# EAGLE design mono3 (EAGLE 5.11)
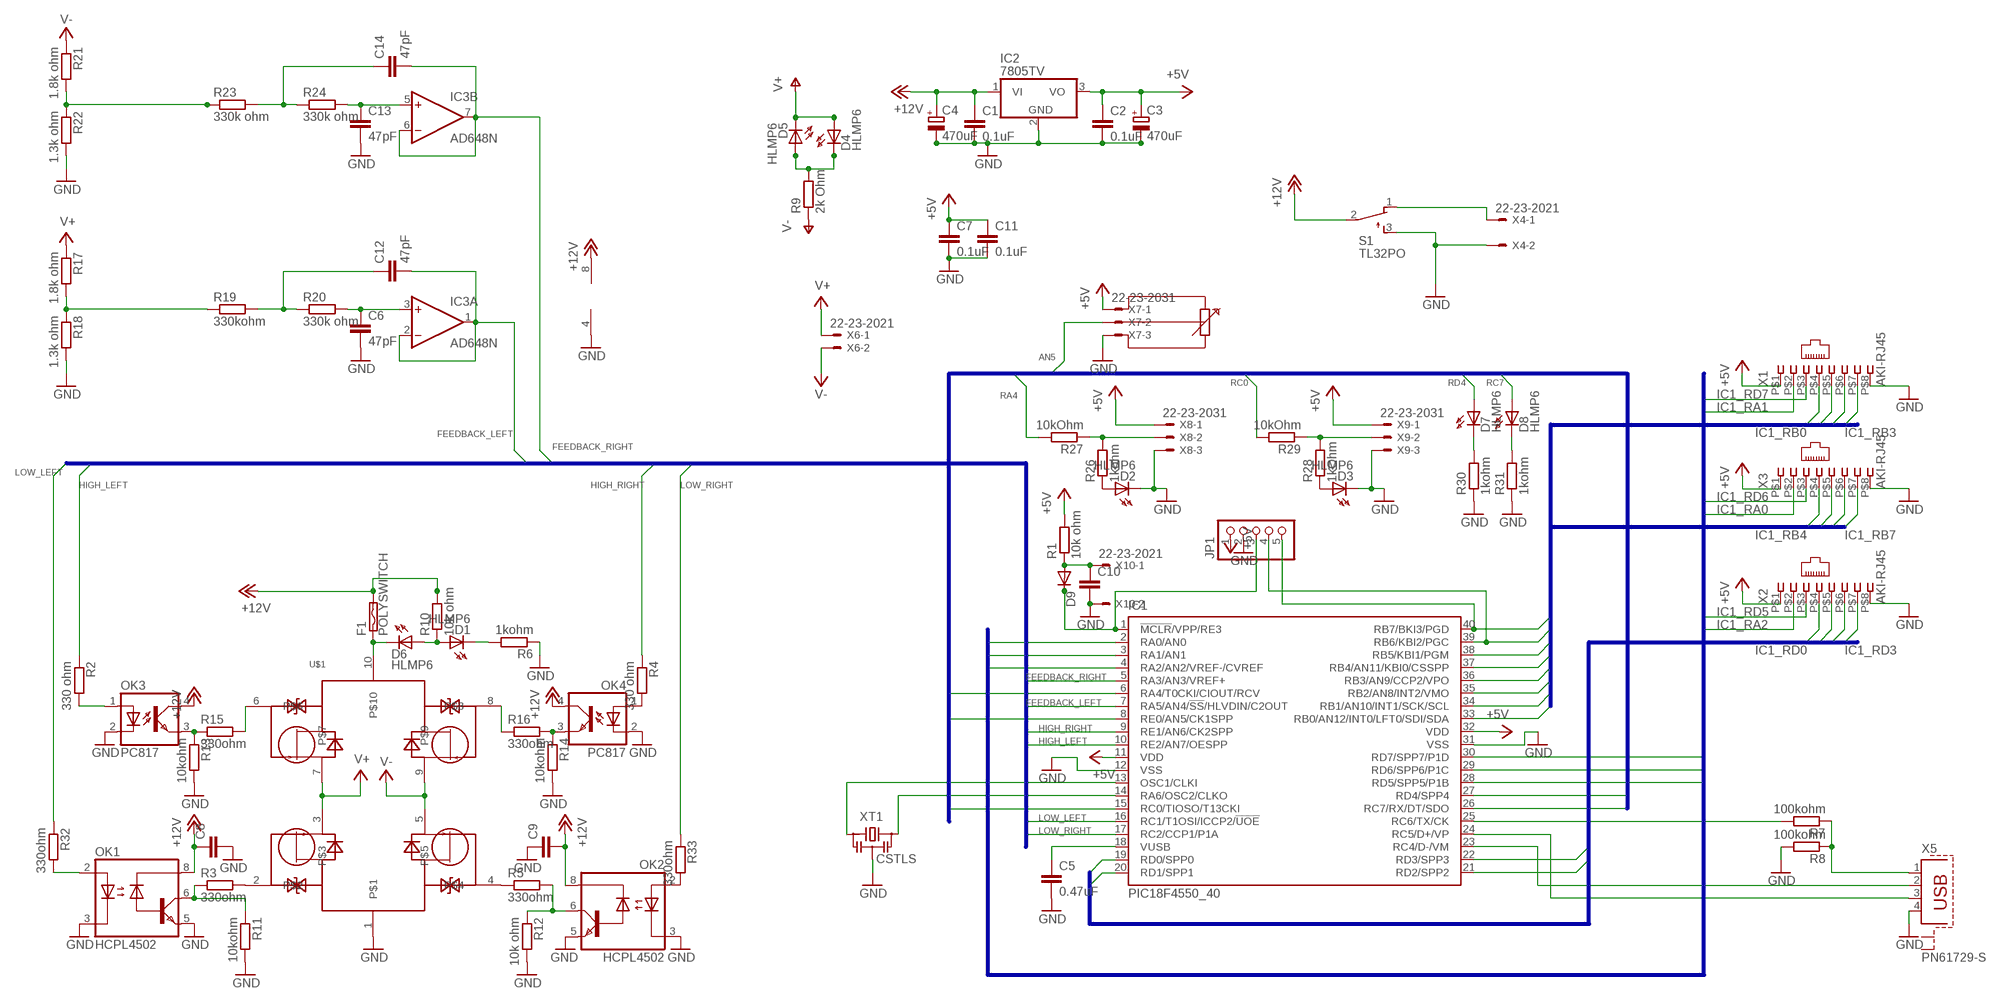
[diagram p0: schematic, sheet 1]

## Parts
C1  0.1uF  C-EU025-025X050  [C025-025X050]
C2  0.1uF  C-EU025-025X050  [C025-025X050]
C3  470uF  CPOL-EUE3.5-8  [E3,5-8]
C4  470uF  CPOL-EUE3.5-8  [E3,5-8]
C5  0.47uF  C-EU025-025X050  [C025-025X050]
C6  47pF  C-EU025-025X050  [C025-025X050]
C7  0.1uF  C2,5-3  [C2.5-3]
C8  C-EU025-025X050  [C025-025X050]
C9  C-EU025-025X050  [C025-025X050]
C10  C2,5-3  [C2.5-3]
C11  0.1uF  C2,5-3  [C2.5-3]
C12  47pF  C-EU025-025X050  [C025-025X050]
C13  47pF  C-EU025-025X050  [C025-025X050]
C14  47pF  C-EU025-025X050  [C025-025X050]
D1  HLMP6  [HLMP6]
D2  HLMP6  [HLMP6]
D3  HLMP6  [HLMP6]
D4  HLMP6  [HLMP6]
D5  HLMP6  [HLMP6]
D6  HLMP6  [HLMP6]
D7  HLMP6  [HLMP6]
D8  HLMP6  [HLMP6]
D9  DIODE-D-2.5  [D-2.5]
F1  POLYSWITCH  [0207/2V]
IC1  PIC18F4550_40  [DIL40]
IC2  7805TV  [TO220V]
IC3  AD648N  [DIL08]
JP1  PINHD-1X5  [1X05]
OK1  HCPL4502  [DIL08]
OK2  HCPL4502  [DIL08]
OK3  PC817  [DIL04]
OK4  PC817  [DIL04]
R1  10k ohm  R-EU_0204/2V  [0204V]
R2  330 ohm  R-EU_0204/2V  [0204V]
R3  330ohm  R-EU_0204/2V  [0204V]
R4  330 ohm  R-EU_0204/2V  [0204V]
R5  330ohm  R-EU_0204/2V  [0204V]
R6  1kohm  R-EU_0204/2V  [0204V]
R7  100kohm  R-EU_0204/2V  [0204V]
R8  100kohm  R-EU_0204/2V  [0204V]
R9  2k Ohm  R-EU_0204/2V  [0204V]
R10  10k ohm  R-EU_0204/2V  [0204V]
R11  10kohm  R-EU_0204/2V  [0204V]
R12  10k ohm  R-EU_0204/2V  [0204V]
R13  10kohm  R-EU_0204/2V  [0204V]
R14  10kohm  R-EU_0204/2V  [0204V]
R15  330ohm  R-EU_0204/2V  [0204V]
R16  330ohm  R-EU_0204/2V  [0204V]
R17  1.8k ohm  R-EU_0204/2V  [0204V]
R18  1.3k ohm  R-EU_0204/2V  [0204V]
R19  330kohm  R-EU_0204/2V  [0204V]
R20  330k ohm  R-EU_0204/2V  [0204V]
R21  1.8k ohm  R-EU_0204/2V  [0204V]
R22  1.3k ohm  R-EU_0204/2V  [0204V]
R23  330k ohm  R-EU_0204/2V  [0204V]
R24  330k ohm  R-EU_0204/2V  [0204V]
R26  1kohm  R-EU_0204/2V  [0204V]
R27  10kOhm  R-EU_0204/2V  [0204V]
R28  1kOhm  R-EU_0204/2V  [0204V]
R29  10kOhm  R-EU_0204/2V  [0204V]
R30  1kohm  R-EU_0204/2V  [0204V]
R31  1kohm  R-EU_0204/2V  [0204V]
R32  330ohm  R-EU_0204/2V  [0204V]
R33  330ohm  R-EU_0204/2V  [0204V]
S1  TL32PO  [TL3XPO]
U$1  MP4212  [SSW-110-02-S-S-RA]
X1  AKI-RJ45  [C-00159]
X2  AKI-RJ45  [C-00159]
X3  AKI-RJ45  [C-00159]
X4  22-23-2021  [22-23-2021]
X5  PN61729-S  [PN61729-S]
X6  22-23-2021  [22-23-2021]
X7  22-23-2031  [22-23-2031]
X8  22-23-2031  [22-23-2031]
X9  22-23-2031  [22-23-2031]
X10  22-23-2021  [22-23-2021]
XT1  CSTLS  [S3P]

## Nets
+5V: C2.1 C3.+ C7.1 C11.1 IC1.11(VDD) IC1.32(VDD) IC2.3(VO) JP1.1 R1.2 X1.P$1 X2.P$1 X3.P$1 X7.1 X8.1 X9.1
+12V [pwr]: C1.1 C4.+ C8.1 C9.2 F1.2 IC2.1(VI) IC3.8(P:V+) OK1.8(VCC) OK2.8(VCC) OK3.4(COL) OK4.4(COL) R10.2 S1.2(P)
AN5: IC1.8(RE0/AN5/CK1SPP) X7.2
FEEDBACK_LEFT: C12.2 IC1.7(RA5/AN4/!SS!/HLVDIN/C2OUT) IC3.1(A:OUT) IC3.2(A:-IN)
FEEDBACK_RIGHT: C14.2 IC1.5(RA3/AN3/VREF+) IC3.6(B:-IN) IC3.7(B:OUT)
GND: C1.2 C2.2 C3.- C4.- C5.2 C6.2 C7.2 C8.2 C9.1 C10.2 C11.2 C13.2 D2.K D3.K IC1.12(VSS) IC1.31(VSS) IC2.2(GND) IC3.4(P:V-) JP1.2 OK1.3(C) OK1.5(GND) OK2.3(C) OK2.5(GND) OK3.2(C) OK4.2(C) R6.1 R8.2 R11.2 R12.2 R13.2 R14.2 R18.2 R22.2 R30.1 R31.1 S1.3(S) U$1.1 X1.P$8 X2.P$8 X3.P$8 X4.2 X5.4 X7.3 X8.3 X9.3 X10.2 XT1.P$2
HIGH_LEFT: IC1.10(RE2/AN7/OESPP) R2.1
HIGH_RIGHT: IC1.9(RE1/AN6/CK2SPP) R4.1
IC1_RA0: IC1.2(RA0/AN0) X3.P$2
IC1_RA1: IC1.3(RA1/AN1) X1.P$2
IC1_RA2: IC1.4(RA2/AN2/VREF-/CVREF) X2.P$2
IC1_RB0: IC1.33(RB0/AN12/INT0/LFT0/SDI/SDA) X1.P$4
IC1_RB1: IC1.34(RB1/AN10/INT1/SCK/SCL) X1.P$5
IC1_RB2: IC1.35(RB2/AN8/INT2/VMO) X1.P$6
IC1_RB3: IC1.36(RB3/AN9/CCP2/VPO) X1.P$7
IC1_RB4: IC1.37(RB4/AN11/KBI0/CSSPP) X3.P$4
IC1_RB5: IC1.38(RB5/KBI1/PGM) X3.P$5
IC1_RB6: IC1.39(RB6/KBI2/PGC) JP1.4 X3.P$6
IC1_RB7: IC1.40(RB7/BKI3/PGD) JP1.5 X3.P$7
IC1_RD0: IC1.19(RD0/SPP0) X2.P$4
IC1_RD1: IC1.20(RD1/SPP1) X2.P$5
IC1_RD2: IC1.21(RD2/SPP2) X2.P$6
IC1_RD3: IC1.22(RD3/SPP3) X2.P$7
IC1_RD5: IC1.28(RD5/SPP5/P1B) X2.P$3
IC1_RD6: IC1.29(RD6/SPP6/P1C) X3.P$3
IC1_RD7: IC1.30(RD7/SPP7/P1D) X1.P$3
LOW_LEFT: IC1.16(RC1/T1OSI/ICCP2/!UOE) R32.1
LOW_RIGHT: IC1.17(RC2/CCP1/P1A) R33.1
N$1: C5.1 IC1.18(VUSB)
N$2: IC1.14(RA6/OSC2/CLKO) XT1.P$3
N$3: R17.2 R18.1 R19.1
N$4: D9.C IC1.1(!MCLR!/VPP/RE3) JP1.3
N$5: R3.2 U$1.2
N$6: C12.1 R19.2 R20.1
N$7: R5.1 U$1.4
N$8 [pwr]: S1.1(O) X4.1
N$9: C6.1 IC3.3(A:+IN) R20.2
N$10: C10.1 D9.A R1.1 X10.1
N$11: C14.1 R23.2 R24.1
N$12: R21.2 R22.1 R23.1
N$13: C13.1 IC3.5(B:+IN) R24.2
N$14: IC1.13(OSC1/CLKI) XT1.P$1
N$15: D1.K R6.2
N$16: IC1.25(RC6/TX/CK) R7.2
N$17: R7.1 R8.1 X5.1
N$18: R26.2 R27.1 X8.2
N$19: D2.A R26.1
N$20: R28.2 R29.1 X9.2
N$21: D3.A R28.1
N$22: D7.K R30.2
N$23: D8.K R31.2
N$24: OK3.1(A) R2.2
N$25 [pwr]: D6.K F1.1 U$1.10
N$26: OK1.6(VO) R3.1 R11.1
N$27: IC1.24(RC5/D+/VP) X5.3
N$28: OK1.2(A) R32.2
N$29: IC1.23(RC4/D-/VM) X5.2
N$30: OK2.6(VO) R5.2 R12.1
N$31: OK2.2(A) R33.2
N$35: D4.K D5.A R9.2
N$36: D1.A D6.A R10.1
N$38: OK4.1(A) R4.2
N$39: R15.2 U$1.6
N$41: OK3.3(EMIT) R13.1 R15.1
N$42: OK4.3(EMIT) R14.1 R16.2
N$43: R16.1 U$1.8
RA4: IC1.6(RA4/T0CKI/CIOUT/RCV) R27.2
RC0: IC1.15(RC0/TIOSO/T13CKI) R29.2
RC7: D8.A IC1.26(RC7/RX/DT/SDO)
RD4: D7.A IC1.27(RD4/SPP4)
V+ [pwr]: D4.A D5.K R17.1 U$1.3 U$1.7 X6.1
V- [pwr]: R9.1 R21.1 U$1.5 U$1.9 X6.2
Unconnected: X5.S1 X5.S2

## Buses
IC1_RB[0..7]
IC1_RD[0..3]
IC1_RA[0..3],IC1_RD[5..7]
HIGH_LEFT,HIGH_RIGHT,LOW_LEFT,LOW_RIGHT,FEEDBACK_LEFT,FEEDBACK_RIGHT
AN5,RA4,RC0,RD4,RC7

## Library data of the parts
C1 C2 C5 C6 C8 C9 C12-C14 = rcl:C-EU: CAPACITOR, European symbol
C3 C4 = rcl:CPOL-EU: POLARIZED CAPACITOR, European symbol
C7 C10 C11 = capacitor-wima:C: CAPACITOR naming: grid - package width
D1-D8 = display-hp:HLMP6: LED 2mm horizontal; MF: AGILENT TECHNOLOGIES; MPN: HLMP-6500; OC_FARNELL: 1652490; OC_NEWARK: 40K0088
D9 = diode:DIODE-: DIODE
F1 = myparts:POLYSWITCH
IC1 = microchip:PIC18F4*_40: USB Microcontrollers with nanoWatt Technology High-Performance, Enhanced Flash, 28/40/44-Pin, Source: http://ww1.microchip.com/downloads/en/devicedoc/39632c.pdf; MF: MICROCHIP; MPN: PIC18F4550-I/P; OC_FARNELL: 9321357; OC_NEWARK: 74K8623
IC2 = linear:78*: Positive VOLTAGE REGULATOR Source: http://cache.national.com/ds/LM/LM78L05.pdf http://www.fairchildsemi.com/ds/LM/LM7805.pdf
IC3 = linear:AD648: OP AMP
JP1 = pinhead:PINHD-1X5: PIN HEADER
OK1 OK2 = optocoupler:HCPL4502: HEWLETT PACKARD OPTO COUPLER; MF: AGILENT TECHNOLOGIES; MPN: HCPL-4502-000E; OC_FARNELL: 9994777; OC_NEWARK: 31K7017
OK3 OK4 = optocoupler:PC817: SHARP OPTO COUPLER; MPN: PC817X4J000F; OC_FARNELL: 9707727; OC_NEWARK: 97K7059
R1 R7 R8 R26-R29 = rcl:R-EU_: RESISTOR, European symbol
R2-R6 R9-R24 R30-R33 = resistor:R-EU_: RESISTOR, European symbol
S1 = switch:TL32PO: TINY SWITCH ON - MOM Source: http://www2.produktinfo.conrad.com/datenblaetter/700000-724999/705152-da-01-de-Subminiaturschalter_TL_36YO.pdf
U$1 = myparts:MP4212
X1-X3 = myparts:AKI-RJ45
X4 X6 X10 = con-molex:22-23-2021: .100" (2.54mm) Center Header - 2 Pin; MF: MOLEX; MPN: 22-23-2021; OC_FARNELL: 1462926; OC_NEWARK: 25C3832
X5 = con-berg:PN61729-S: BERG USB connector; OC_FARNELL: unknown; OC_NEWARK: unknown
X7-X9 = con-molex:22-23-2031: .100" (2.54mm) Center Header - 3 Pin; MF: MOLEX; MPN: 22-23-2031; OC_FARNELL: 1462950; OC_NEWARK: 30C0862
XT1 = TOG:CSTLS: Resonator, Murata Ceralock

## Net classes
1 pwr: width 0.762 mm

## Board
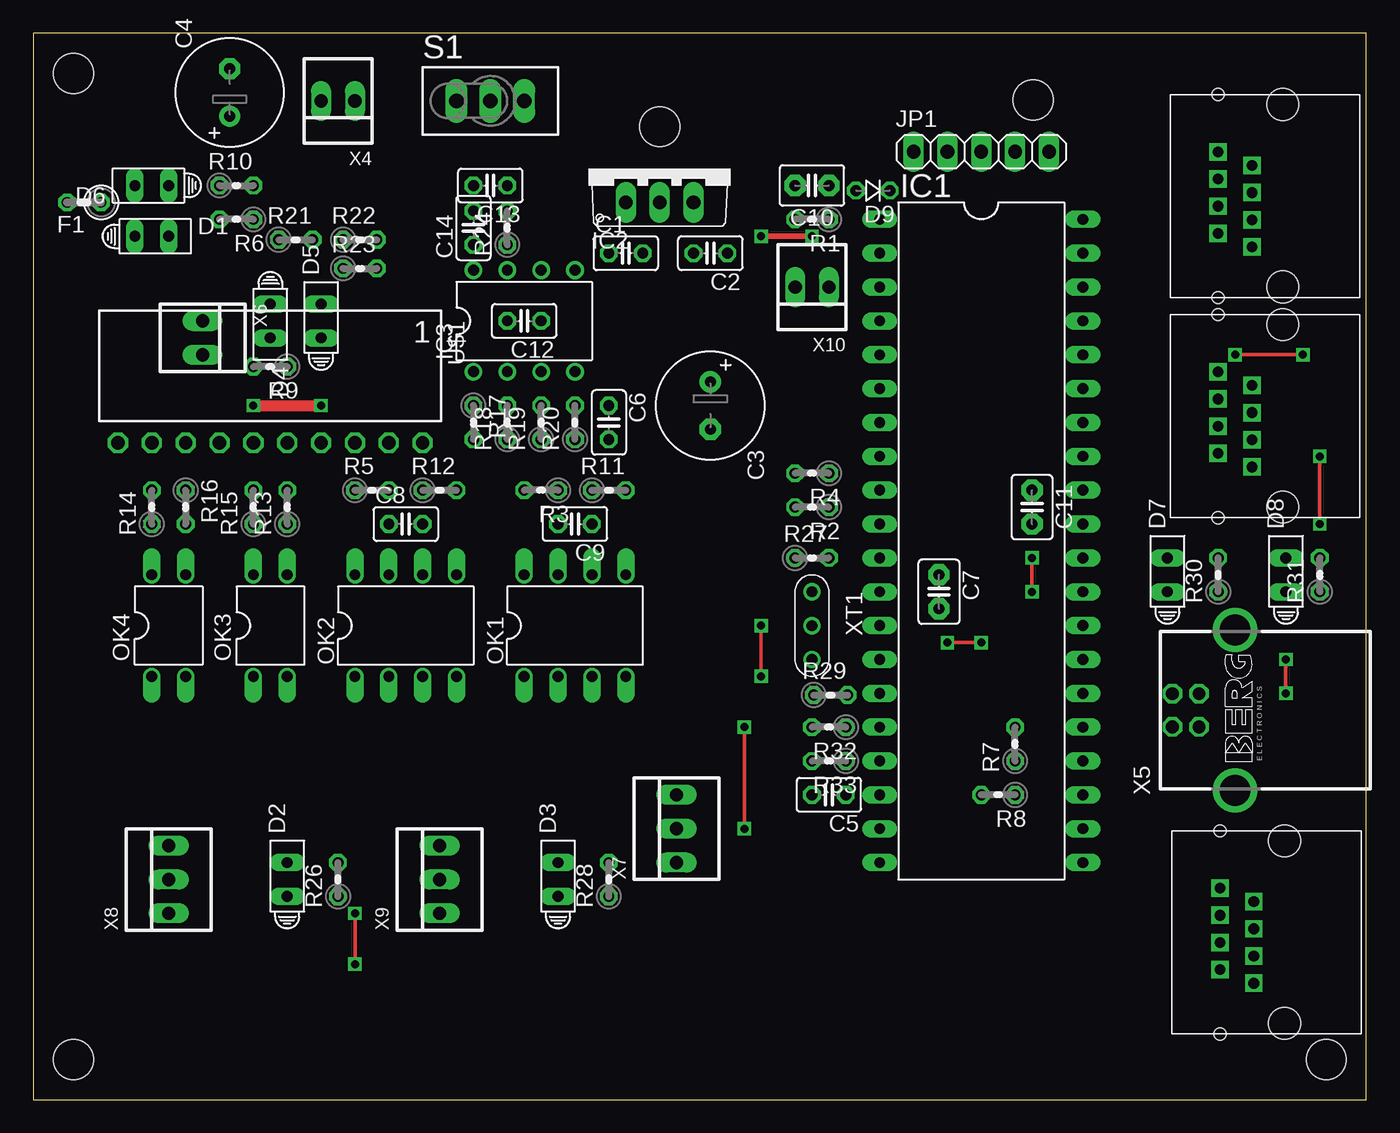
[diagram p1: board, top side]
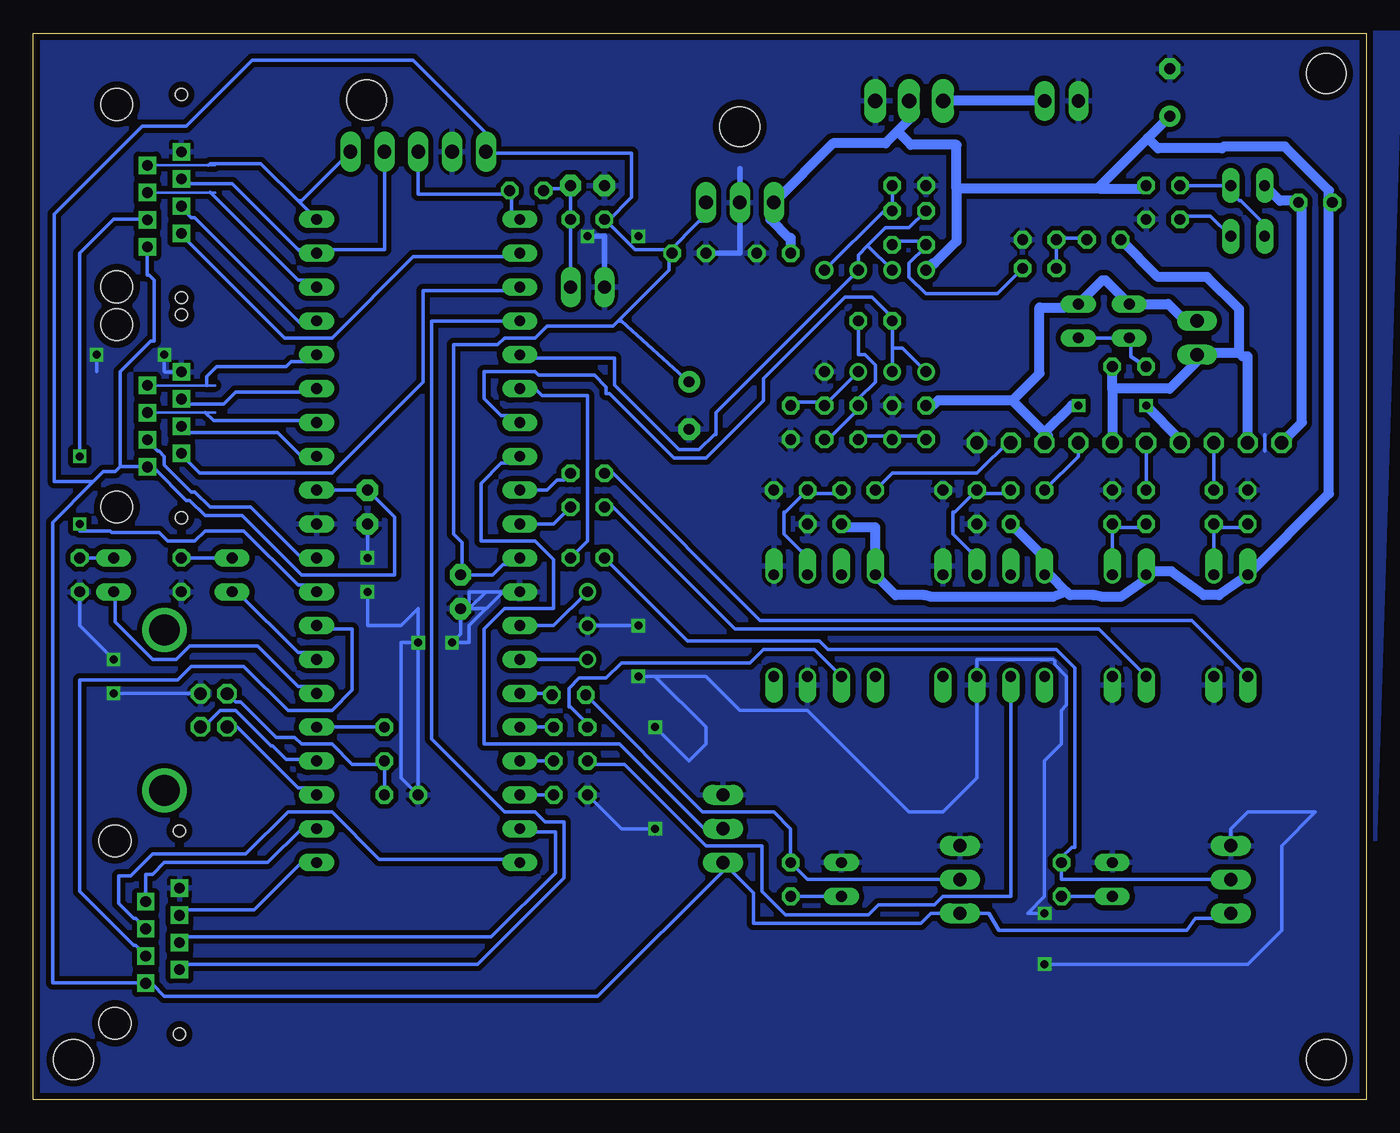
[diagram p2: board, bottom side, seen from below]

Size 100 x 80 mm. Coordinates in mm from the lower left corner, seen from the top.
Outline: 0,0 100,0 100,80 0,80 0,0
Copper layers (1*16): Top 0.035mm / dielectric 1.5mm / Bottom 0.035mm
Design rules "default *": minimum track width 10mil, minimum drill 24mil, track to track 15mil, track to pad 15mil, pad to pad 15mil, via to via 15mil, smd to smd 15mil, copper to edge 20mil, drill to drill 8mil, minimum pad ring 10mil, minimum via ring 8mil, stop-mask expansion 4mil, vias tented up to drill 0mil, thermal gap 10mil
Holes 3 mm at 3,3 3,77 97,3 75,75 47,73

### Footprints (pad centres in the part's own frame; a part is rotated, then mirrored left to right if it is on the bottom)
C025-025X050 = drill 0.813 octagon: 1 -1.27,0; 2 1.27,0
E3,5-8 = drill 0.813 pad 1.6 round: + -1.778,0 | drill 0.813 pad 1.6 octagon: - 1.778,0
C2.5-3 = drill 0.813 pad 1.6 octagon: 1 -1.27,0; 2 1.27,0
HLMP6 = drill 0.813 long: A -1.27,0; K 1.27,0
D-2.5 = drill 0.813 octagon: A 1.27,0; C -1.27,0
0207/2V = drill 0.813 octagon: 1 -1.27,0; 2 1.27,0
DIL40 = drill 0.813 long: 1 -24.13,-7.62; 2 -21.59,-7.62; 3 -19.05,-7.62; 4 -16.51,-7.62; 5 -13.97,-7.62; 6 -11.43,-7.62; 7 -8.89,-7.62; 8 -6.35,-7.62; 9 -3.81,-7.62; 10 -1.27,-7.62; 11 1.27,-7.62; 12 3.81,-7.62; 13 6.35,-7.62; 14 8.89,-7.62; 15 11.43,-7.62; 16 13.97,-7.62; 17 16.51,-7.62; 18 19.05,-7.62; 19 21.59,-7.62; 20 24.13,-7.62; 21 24.13,7.62; 22 21.59,7.62; 23 19.05,7.62; 24 16.51,7.62; 25 13.97,7.62; 26 11.43,7.62; 27 8.89,7.62; 28 6.35,7.62; 29 3.81,7.62; 30 1.27,7.62; 31 -1.27,7.62; 32 -3.81,7.62; 33 -6.35,7.62; 34 -8.89,7.62; 35 -11.43,7.62; 36 -13.97,7.62; 37 -16.51,7.62; 38 -19.05,7.62; 39 -21.59,7.62; 40 -24.13,7.62
TO220V = drill 1.016 long: 1 -2.54,-2.54; 2 0,-2.54; 3 2.54,-2.54
DIL08 = drill 0.813 pad 1.27 round: 1 -3.81,-3.81; 2 -1.27,-3.81; 3 1.27,-3.81; 4 3.81,-3.81; 5 3.81,3.81; 6 1.27,3.81; 7 -1.27,3.81; 8 -3.81,3.81
1X05 = drill 1.016 long: 1 -5.08,0; 2 -2.54,0; 3 0,0; 4 2.54,0; 5 5.08,0
DIL08' = drill 0.813 offset: 1 -3.81,-3.81; 2 -1.27,-3.81; 3 1.27,-3.81; 4 3.81,-3.81; 5 3.81,3.81; 6 1.27,3.81; 7 -1.27,3.81; 8 -3.81,3.81
DIL04 = drill 0.813 offset: 1 -1.27,-3.81; 2 1.27,-3.81; 3 1.27,3.81; 4 -1.27,3.81
0204V = drill 0.813 octagon: 1 -1.27,0; 2 1.27,0
TL3XPO = drill 1.1 pad 1.422 long: 1 -2.54,0; 2 0,0; 3 2.54,0
SSW-110-02-S-S-RA = drill 1 pad 1.5 octagon: 1 -11.43,1.524; 2 -8.89,1.524; 3 -6.35,1.524; 4 -3.81,1.524; 5 -1.27,1.524; 6 1.27,1.524; 7 3.81,1.524; 8 6.35,1.524; 9 8.89,1.524; 10 11.43,1.524
C-00159 = drill 0.8 square: P$1 0,0.8; P$2 2.54,-0.22; P$3 0,-1.24; P$4 2.54,-2.26; P$5 0,-3.28; P$6 2.54,-4.3; P$7 0,-5.32; P$8 2.54,-6.34 | hole 2.4: -2.3,-9.885; -2.3,3.805 | hole 0.9: 2.54,4.605; 2.54,-10.635
22-23-2021 = drill 1 long: 1 -1.27,0; 2 1.27,0
PN61729-S = drill 0.95 octagon: 1 1.25,4.71; 2 -1.25,4.71; 3 -1.25,2.71; 4 1.25,2.71 | drill 2.3 pad 2.9 round: S1 -6.02,0; S2 6.02,0
22-23-2031 = drill 1 long: 1 -2.54,0; 2 0,0; 3 2.54,0
S3P = drill 0.8 round: P$1 -2.54,0; P$2 0,0; P$3 2.54,0

### Placement (x,y rotation side)
C1  44.45,63.5 0 top
C2  50.8,63.5 180 top
C3  50.8,52.07 270 top
C4  14.73,75.56 90 top
C5  59.69,22.86 180 top
C6  43.18,50.8 270 top
C7  67.94,38.1 270 top
C8  27.94,43.18 0 top
C9  40.64,43.18 180 top
C10  58.42,68.58 180 top
C11  74.93,44.45 270 top
C12  36.83,58.42 180 top
C13  34.29,68.58 180 top
C14  33.02,65.41 90 top
D1  8.89,64.77 0 top
D2  19.05,16.51 90 top
D3  39.37,16.51 90 top
D4  17.78,58.42 270 top
D5  21.59,58.42 90 top
D6  8.89,68.58 180 top
D7  85.09,39.37 90 top
D8  93.98,39.37 90 top
D9  62.99,68.2 180 top
F1  3.81,67.31 180 top
IC1  71.12,41.91 270 top
IC2  46.99,69.85 0 top
IC3  36.83,58.42 0 top
JP1  71.12,71.12 0 top
OK1  HCPL4502  [DIL08']  40.64,35.56 0 top
OK2  HCPL4502  [DIL08']  27.94,35.56 0 top
OK3  17.78,35.56 0 top
OK4  10.16,35.56 0 top
R1  58.42,66.04 180 top
R2  58.42,44.45 180 top
R3  38.1,45.72 180 top
R4  58.42,46.99 180 top
R5  25.4,45.72 0 top
R6  15.24,66.04 180 top
R7  73.66,26.67 90 top
R8  72.39,22.86 180 top
R9  17.78,54.99 180 top
R10  15.24,68.58 0 top
R11  43.18,45.72 0 top
R12  30.48,45.72 0 top
R13  19.05,44.45 90 top
R14  8.89,44.45 90 top
R15  16.51,44.45 90 top
R16  11.43,44.45 270 top
R17  33.02,50.8 270 top
R18  35.56,50.8 90 top
R19  38.1,50.8 90 top
R20  40.64,50.8 90 top
R21  19.68,64.52 0 top
R22  24.51,64.52 0 top
R23  24.51,62.36 0 top
R24  35.56,65.41 90 top
R26  22.86,16.51 90 top
R27  58.42,40.64 0 top
R28  43.18,16.51 90 top
R29  59.82,30.35 0 top
R30  88.9,39.37 90 top
R31  96.52,39.37 90 top
R32  59.69,27.94 180 top
R33  59.69,25.4 180 top
S1  34.29,74.93 0 top
U$1  17.78,50.8 180 top
X1  91.44,48.26 180 top
X2  91.57,9.53 180 top
X3  91.44,64.77 180 top
X4  22.86,74.93 180 top
X5  90.17,29.21 90 top
X6  12.7,57.15 270 top
X7  48.26,20.32 90 top
X8  10.16,16.51 90 top
X9  30.48,16.51 90 top
X10  58.42,60.96 180 top
XT1  58.42,35.56 270 top

### Tracks (layer width: path | path; a pad name or v marks a point on that pad's centre or on a via)
+5V
  Bottom 0.254: X8.1 10.54,13.59 12.83,13.59 13.46,12.7 27.56,12.7 28.32,13.97 X9.1 32.64,13.97 33.4,13.21 45.97,13.21 45.97,15.49 X7.1 48.01,17.4 57.66,7.75 90.17,7.75 91.06,8.64 91.57,8.64 X2.P$1 91.57,8.76 98.55,8.76 98.55,43.31 95.57,46.29 | IC1.11 64.01,40.13 64.77,40.13 65.53,39.37 67.82,39.37 | 67.82,39.37 67.82,41.78 68.45,42.42 68.45,56.64 65.15,56.64 64.64,57.15 62.36,57.15 61.47,58.04 56.52,58.04 56.07,58.48 | 56.07,58.48 52.32,62.23 52.32,63.5 | 67.82,39.37 C7.1 | IC1.32 C11.1 72.9,43.69 72.9,39.37 79.88,39.37 84.33,43.81 87.12,43.81 88.27,44.96 88.52,44.96 90.93,47.37 | 90.93,47.37 91.44,47.37 X1.P$1 | X1.P$1 90.93,47.37 | 93.47,47.5 93.47,54.61 91.19,56.9 90.93,56.9 90.93,61.47 91.31,61.85 91.44,61.85 X3.P$1 | 93.47,47.5 91.44,47.5 X1.P$1 | 93.47,47.5 93.85,47.12 94.74,47.12 95.57,46.29 | 95.57,46.29 95.63,46.35 98.42,46.35 98.42,66.42 91.82,73.03 88.52,73.03 83.57,77.98 71.5,77.98 65.41,71.88 JP1.1 66.04,70.99 55.12,70.99 55.12,67.69 56.9,65.91 R1.2 54.86,63.75 52.7,63.75 52.45,63.5 52.32,63.5 | 52.32,63.5 C2.1 52.45,63.63 52.32,63.63 50.04,65.91 49.53,65.91 IC2.3 | C3.+ 55.88,58.42 56.01,58.42 56.07,58.48
+12V
  Bottom 0.762: OK2.8 24.13,40.64 | C9.2 39.24,43.18 38.99,42.93 36.83,42.93 OK1.8 35.31,37.85 33.15,37.85 32.64,37.72 23.5,37.72 22.48,38.1 | C8.1 24.38,40.89 OK2.8 | 22.48,38.1 22.23,37.85 20.45,37.85 19.81,37.72 18.41,37.72 16.38,39.12 OK3.4 16.26,39.62 14.61,39.62 12.19,37.85 11.05,37.85 OK4.4 2.79,45.47 2.79,67.06 F1.2 2.79,67.56 2.79,68.2 6.1,71.5 10.67,71.5 10.79,71.37 15.62,71.37 16.38,72.14 | 22.48,38.1 23.75,39.37 OK2.8 | C1.1 43.18,64.64 43.31,64.64 44.7,66.04 44.7,67.31 IC2.1 40.01,71.75 36.07,71.75 35.18,72.64 | 35.18,72.64 34.29,73.53 S1.2 | IC3.8 32.51,62.74 32.38,62.74 30.73,64.39 30.73,68.33 | 30.73,68.33 30.73,71.63 34.16,71.63 35.18,72.64 | 19.94,68.33 16.76,68.33 R10.2 | 19.94,68.33 30.73,68.33 | 16.38,72.14 19.94,68.58 19.94,68.33 | 16.38,72.14 C4.+
AN5
  Bottom 0.254: IC1.8 64.01,47.75 64.9,47.75 66.42,46.23 66.42,41.91 62.36,41.91 60.96,40.51 60.96,36.83 64.64,36.83 66.17,35.31 66.17,26.67 56.01,26.67 49.66,20.32 X7.2
FEEDBACK_LEFT
  Bottom 0.254: 35.56,56.39 IC3.2 | 35.56,56.39 C12.2 35.56,58.67 37.08,60.2 39.12,60.2 45.21,54.1 45.21,52.45 49.53,48.13 51.94,48.13 56.77,52.96 57.02,52.96 57.02,53.47 57.91,54.36 62.1,54.36 62.36,54.61 66.17,54.61 66.17,52.58 64.9,51.31 64.01,51.31 IC1.7 | IC3.1 34.8,56.39 35.56,56.39
FEEDBACK_RIGHT
  Bottom 0.254: C14.2 34.29,65.41 36.07,65.41 37.4,64.07 | 37.4,64.07 38.1,63.37 IC3.6 48.77,51.56 48.77,49.91 48.9,49.91 50.04,48.77 51.56,48.77 56.39,53.59 56.39,55.63 62.23,55.63 62.48,55.88 IC1.5 | IC3.7 37.4,64.07
GND  (via drill 0.6)
  Top 0.254: v53.34,27.94 v53.34,20.32 | v24.13,10.16 v24.13,13.97 | v74.93,38.1 v74.93,40.64 | v54.61,31.75 v54.61,35.56 | v71.12,34.29 v68.58,34.29 | v93.98,30.48 v93.98,33.02 | v90.17,55.88 v95.25,55.88
  Top 0.406: v54.61,64.77 v58.42,64.77
  Bottom 0.254: v53.34,27.94 50.8,25.4 49.53,26.67 49.53,27.94 53.34,31.75 v54.61,31.75 49.53,31.75 46.99,29.21 41.91,29.21 34.29,21.59 31.75,21.59 29.21,24.13 OK2.3 29.21,33.02 23.5,33.02 23.37,32.89 23.37,32.64 22.48,31.75 22.48,29.59 22.86,29.21 22.86,26.67 24.13,25.4 24.13,15.24 25.4,13.97 v24.13,13.97 | v53.34,20.32 55.88,20.32 C5.2 | v24.13,10.16 8.89,10.16 6.35,12.7 6.35,19.05 3.81,21.59 8.89,21.59 10.16,20.32 X8.3 | v74.93,40.64 C11.2 | v74.93,38.1 74.93,35.56 72.39,35.56 71.12,36.83 v71.12,34.29 | v71.12,34.29 R8.2 72.39,24.13 72.39,34.29 v71.12,34.29 | C7.2 67.94,34.92 v68.58,34.29 67.31,34.29 67.31,35.56 64.77,38.1 IC1.12 66.04,38.1 | 66.04,38.1 67.31,36.83 | 66.04,38.1 67.31,38.1 67.31,36.83 | 67.31,36.83 66.04,36.83 | v54.61,35.56 XT1.P$2 | X5.4 93.96,30.46 v93.98,30.48 | v93.98,33.02 96.52,35.56 R31.1 | X1.P$8 90.16,54.6 90.17,54.61 v90.17,55.88 | v95.25,55.88 95.25,54.61 | 7.62,48.65 7.62,49.9
  Bottom 0.406: C2.2 46.99,63.5 46.99,69.85 | v58.42,64.77 57.15,64.77 57.15,62.23
  pour Bottom: -2.54,80.01 0,0 100.33,0 100.33,80.01
HIGH_LEFT
  Bottom 0.254: R2.1 60.96,43.18 IC1.10
HIGH_RIGHT
  Bottom 0.254: R4.1 60.2,46.48 60.71,46.48 61.47,45.72 IC1.9
IC1_RA0
  Bottom 0.254: IC1.2 64.52,63.5 64.77,63.25 71.5,63.25 77.6,57.15 81.15,57.15 88.9,64.9 X3.P$2
IC1_RA1
  Bottom 0.254: IC1.3 64.52,60.96 64.77,60.71 70.74,60.71 70.74,53.85 77.6,46.99 87.5,46.99 88.9,48.39 X1.P$2
IC1_RA2
  Bottom 0.254: IC1.4 70.1,58.42 70.1,27.05 64.64,21.59 62.36,21.59 61.59,20.83 60.2,20.83 60.2,16.64 66.67,10.16 88.65,10.16 89.03,9.78 X2.P$2
IC1_RB0
  Bottom 0.254: IC1.33 79.88,48.26 81.66,50.04 88.52,50.04 88.9,50.42 X1.P$4
IC1_RB1
  Bottom 0.2: 86.36,51.54 87.12,51.54 X1.P$5
  Bottom 0.254: IC1.34 78.87,50.93 86.49,50.93 87.12,51.56 87.12,51.54
IC1_RB2
  Bottom 0.254: IC1.35 79.76,53.34 80.01,53.09 84.84,53.09 85.72,52.2 88.65,52.2 88.9,52.45 X1.P$6
IC1_RB3
  Bottom 0.2: 86.36,53.58 87,53.58 X1.P$7
  Bottom 0.254: IC1.36 79.25,55.37 80.64,55.37 81.03,54.99 86.23,54.99 87,54.23 87,53.58
IC1_RB4
  Bottom 0.254: IC1.37 78.87,58.29 80.01,58.29 87.88,66.17 88.14,66.17 88.9,66.93 X3.P$4
IC1_RB5
  Bottom 0.2: 86.36,68.05 86.74,68.05 X3.P$5
  Bottom 0.254: IC1.38 79.25,61.47 80.14,61.47 86.74,68.07 86.74,68.05
IC1_RB6
  Bottom 0.254: X3.P$6 88.9,68.96 88.65,68.71 85.09,68.71 79.88,63.5 IC1.39 80.01,63.75 73.66,63.75 JP1.4
IC1_RB7
  Bottom 0.2: 86.36,70.09 86.87,70.09 X3.P$7
  Bottom 0.254: IC1.40 80.07,67.37 | 80.07,67.37 82.93,70.23 86.74,70.23 86.87,70.1 86.87,70.09 | JP1.5 79.88,67.44 80.01,67.44 80.07,67.37
IC1_RD0
  Bottom 0.254: IC1.19 62.48,20.32 62.23,20.07 60.83,20.07 60.83,17.02 65.66,12.19 88.65,12.19 89.03,11.81 X2.P$4
IC1_RD1
  Bottom 0.254: IC1.20 64.52,17.78 64.77,18.03 74.04,18.03 77.6,21.59 80.9,21.59 84.07,18.41 91.06,18.41 92.71,16.76 93.6,16.76 93.6,14.73 92.46,13.59 92.33,13.59 91.57,12.83 X2.P$5
IC1_RD2
  Bottom 0.254: IC1.21 79.88,17.78 83.44,14.22 88.65,14.22 89.03,13.84 X2.P$6
IC1_RD3
  Bottom 0.254: IC1.22 79.88,20.32 82.42,17.78 90.17,17.78 91.06,16.89 91.57,16.89 X2.P$7
IC1_RD5
  Bottom 0.254: IC1.28 77.72,35.56 77.47,35.31 76.07,35.31 76.07,30.73 77.6,29.21 80.9,29.21 84.2,32.51 88.14,32.51 89.15,31.5 96.52,31.5 96.52,15.62 92.46,11.56 92.33,11.56 91.57,10.79 X2.P$3
IC1_RD6  (via drill 0.6)
  Top 0.254: v96.52,43.18 v96.52,48.26
  Bottom 0.254: v96.52,43.18 96.52,42.67 94.23,42.67 94.11,42.55 90.55,42.55 89.92,41.91 87.88,41.91 87.12,42.67 84.2,42.67 80.14,38.61 79.25,38.61 IC1.29 | v96.52,48.26 96.52,63.5 93.98,66.04 91.47,66.04 X3.P$3
IC1_RD7
  Bottom 0.254: X1.P$3 91.44,49.4 90.68,48.64 90.55,48.64 90.17,48.26 90.17,47.62 88.14,45.59 87.88,45.59 86.74,44.45 83.69,44.45 79.88,40.64 IC1.30
LOW_LEFT
  Bottom 0.254: R32.1 IC1.16
LOW_RIGHT
  Bottom 0.254: R33.1 IC1.17
N$1
  Bottom 0.254: C5.1 IC1.18
N$2
  Bottom 0.254: XT1.P$3 IC1.14
N$3
  Bottom 0.254: R17.2 33.27,49.78 34.92,49.78 35.18,49.53 R18.1 35.05,49.78 37.85,49.78 R19.1
N$4
  Bottom 0.254: IC1.1 64.14,66.67 64.14,67.94 | 64.14,67.94 64.14,68.2 D9.C 64.14,67.94 | JP1.3 71.12,67.94 64.14,67.94
N$5
  Bottom 0.254: R3.2 35.56,46.99 29.21,46.99 26.67,49.53 U$1.2
N$6
  Bottom 0.254: R20.1 40.39,49.53 38.35,51.56 38.1,51.56 R19.2 38.1,52.58 36.83,53.85 36.83,55.12 37.59,55.88 38.1,55.88 C12.1
N$7
  Bottom 0.254: R5.1 21.59,48.26 U$1.4 21.59,49.53
N$8
  Bottom 0.762: X4.1 S1.1
N$9
  Bottom 0.254: IC3.3 R20.2 40.51,52.32 42.93,52.32 C6.1
N$10
  Bottom 0.254: 59.69,68.33 R1.1 X10.1 | D9.A 61.59,68.33 59.69,68.33 | 59.69,68.33 C10.1
N$11
  Bottom 0.254: R23.2 27.69,60.45 33.02,60.45 34.29,61.72 34.29,62.74 33.02,64.01 C14.1 33.15,64.01 33.27,64.01 33.66,64.39 35.31,64.39 R24.1
N$12
  Bottom 0.254: R21.2 21.08,64.64 23.11,64.64 R22.1 R23.1
N$13
  Bottom 0.254: IC3.5 36.2,66.67 R24.2 C13.1
N$14
  Bottom 0.254: XT1.P$1 60.96,35.56 IC1.13
N$15
  Bottom 0.254: D1.K 11.68,66.29 13.34,66.29 13.59,66.04 R6.2
N$16
  Bottom 0.254: R7.2 IC1.25
N$17
  Bottom 0.254: R8.1 73.66,25.15 | 73.66,25.15 76.07,25.15 77.6,26.67 79.88,26.67 80.39,27.18 81.79,27.18 84.45,29.84 84.84,29.84 85.34,30.35 X5.1 | 73.66,25.15 R7.1
N$18
  Bottom 0.254: X8.2 22.86,16.51 R26.2 22.86,18.16 22.1,18.92 21.84,18.92 21.84,32.38 23.24,33.78 40.39,33.78 41.02,34.42 50.93,34.42 R27.1
N$19
  Bottom 0.254: D2.A R26.1
N$20
  Bottom 0.254: X9.2 41.91,16.51 R28.2 43.18,20.32 44.45,21.59 49.78,21.59 R29.1
N$21
  Bottom 0.254: D3.A R28.1
N$22
  Bottom 0.254: D7.K R30.2
N$23
  Bottom 0.254: D8.K R31.2
N$24
  Bottom 0.254: OK3.1 20.07,35.31 47.37,35.31 56.52,44.45 R2.2
N$25
  Bottom 0.762: U$1.10 4.83,50.8 4.83,67.06 F1.1 5.46,67.31 5.59,67.44 6.48,67.44 D6.K
N$26
  Bottom 0.254: OK1.6 41.91,41.15 42.42,41.15 43.69,42.42 43.69,44.07 43.56,44.07 R11.1 42.04,45.47 39.62,45.47 R3.1
N$27
  Bottom 0.254: IC1.24 78.87,25.53 81.03,25.53 82.04,26.54 82.17,26.54 84.84,29.21 85.98,29.21 87.12,28.07 87.38,28.07 X5.3
N$28
  Bottom 0.254: OK1.2 41.4,33.78 45.21,33.78 46.23,32.77 55.88,32.77 57.02,31.62 59.05,31.62 59.82,30.86 59.82,29.46 59.69,29.46 58.42,28.19 R32.2
N$29
  Bottom 0.254: IC1.23 79.25,23.37 80.14,23.37 84.71,27.94 85.34,27.94 X5.2
N$30
  Bottom 0.254: OK2.6 29.21,41.15 29.72,41.15 30.99,42.42 30.99,44.07 30.86,44.07 R12.1 29.34,45.47 26.92,45.47 R5.2
N$31
  Bottom 0.254: OK2.2 26.67,15.24 31.75,15.24 32.38,14.61 36.58,14.61 37.34,13.84 43.56,13.84 45.34,15.62 45.34,19.05 49.53,19.05 55.63,25.15 57.78,25.15 58.04,25.4 R33.2
N$35
  Bottom 0.254: R9.2 17.65,55.75 17.65,57.15 D4.K D5.A
N$36
  Bottom 0.254: 10.67,68.58 R10.1 | D1.A 7.62,65.91 7.87,65.91 9.4,67.44 9.53,67.44 10.67,68.58 | 10.67,68.58 D6.A
N$38
  Bottom 0.254: OK4.1 13.08,35.94 45.47,35.94 56.52,46.99 R4.2
N$39
  Bottom 0.254: R15.2 U$1.6
N$41
  Bottom 0.254: OK3.3 19.05,42.93 | R15.1 16.76,42.93 19.05,42.93 | 19.05,42.93 R13.1
N$42
  Bottom 0.254: OK4.3 11.43,42.93 | R14.1 9.14,42.93 11.43,42.93 | 11.43,42.93 R16.2
N$43
  Bottom 0.254: R16.1 U$1.8
RA4
  Bottom 0.254: R27.2 58.42,41.91 58.42,52.83 61.85,52.83 62.36,53.34 IC1.6
RC0
  Bottom 0.254: R29.2 61.21,30.48 IC1.15
RC7
  Bottom 0.254: IC1.26 79.25,30.99 80.14,30.99 83.19,34.04 88.27,34.04 89.28,33.02 91.06,33.02 93.85,35.81 93.85,38.1 D8.A
RD4
  Bottom 0.254: IC1.27 79.25,33.53 80.14,33.53 84.71,38.1 D7.A
V+  (via drill 0.6)
  Top 0.813: v16.51,52.07 v21.59,52.07
  Bottom 0.762: D5.K 21.84,59.56 | U$1.3 23.75,49.28 | U$1.3 24.13,49.53 | v16.51,52.07 13.97,49.53 U$1.7 | 32.77,51.82 R17.1 32.51,52.07 32.13,52.45 26.54,52.45 | 24.13,50.04 23.88,49.78 U$1.3 | 24.13,50.04 26.54,52.45 | v21.59,52.07 22.1,52.07 24.13,50.04 | D5.K 19.81,61.47 19.56,61.47 D4.A 14.86,59.69 13.84,58.67 12.95,58.67 X6.1 | 26.54,52.45 24.51,54.48 24.51,59.44 22.61,59.44 22.48,59.56 22.23,59.56 D5.K
V-
  Bottom 0.762: 19.05,53.34 U$1.5 | 19.05,53.34 R9.1 | 9.53,56.01 12.57,56.01 X6.2 12.45,55.63 14.73,53.34 19.05,53.34 | U$1.9 8.89,55.75 9.27,55.75 9.53,56.01 | R21.1 15.62,61.72 11.94,61.72 9.53,59.31 9.53,56.01